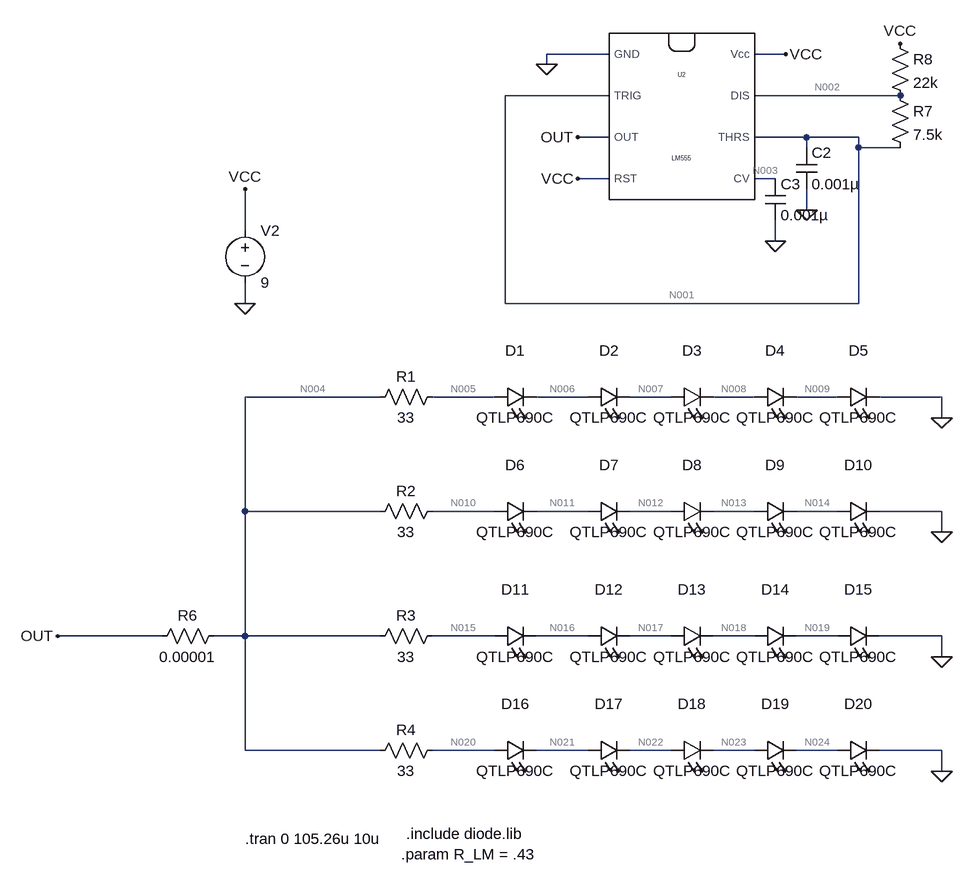
[diagram p0: schematic IR_Tx.asc]
IR_Tx.asc, the LTspice schematic file:
Version 4
SHEET 1 1028 680
WIRE 496 -848 400 -848
WIRE 768 -848 720 -848
WIRE 400 -832 400 -848
WIRE 496 -784 336 -784
WIRE 944 -784 720 -784
WIRE 496 -720 448 -720
WIRE 800 -720 720 -720
WIRE 880 -720 800 -720
WIRE 800 -704 800 -720
WIRE 880 -704 880 -720
WIRE 944 -704 880 -704
WIRE 496 -656 448 -656
WIRE 752 -656 720 -656
WIRE 800 -608 800 -640
WIRE -64 -576 -64 -640
WIRE 752 -560 752 -592
WIRE -64 -464 -64 -496
WIRE 336 -464 336 -784
WIRE 880 -464 880 -704
WIRE 880 -464 336 -464
WIRE 144 -320 -64 -320
WIRE 320 -320 224 -320
WIRE 464 -320 384 -320
WIRE 592 -320 528 -320
WIRE 720 -320 656 -320
WIRE 848 -320 784 -320
WIRE 1008 -320 912 -320
WIRE 1008 -288 1008 -320
WIRE -64 -144 -64 -320
WIRE 144 -144 -64 -144
WIRE 320 -144 224 -144
WIRE 464 -144 384 -144
WIRE 592 -144 528 -144
WIRE 720 -144 656 -144
WIRE 848 -144 784 -144
WIRE 1008 -144 912 -144
WIRE 1008 -112 1008 -144
WIRE -192 48 -352 48
WIRE -64 48 -64 -144
WIRE -64 48 -112 48
WIRE 144 48 -64 48
WIRE 320 48 224 48
WIRE 464 48 384 48
WIRE 592 48 528 48
WIRE 720 48 656 48
WIRE 848 48 784 48
WIRE 1008 48 912 48
WIRE 1008 80 1008 48
WIRE -64 224 -64 48
WIRE 144 224 -64 224
WIRE 320 224 224 224
WIRE 464 224 384 224
WIRE 592 224 528 224
WIRE 720 224 656 224
WIRE 848 224 784 224
WIRE 1008 224 912 224
WIRE 1008 256 1008 224
FLAG 1008 -288 0
FLAG 1008 -112 0
FLAG 1008 80 0
FLAG 1008 256 0
FLAG -64 -464 0
FLAG -64 -640 VCC
FLAG 400 -832 0
FLAG 800 -608 0
FLAG 944 -864 VCC
FLAG 768 -848 VCC
FLAG 448 -720 OUT
FLAG 448 -656 VCC
FLAG 752 -560 0
FLAG -352 48 OUT
SYMBOL res 240 -336 R90
WINDOW 0 0 56 VBottom 2
WINDOW 3 32 56 VTop 2
SYMATTR InstName R1
SYMATTR Value 33
SYMBOL LED 320 -304 R270
WINDOW 0 72 32 VTop 2
WINDOW 3 0 32 VBottom 2
SYMATTR InstName D1
SYMATTR Value QTLP690C
SYMBOL LED 464 -304 R270
WINDOW 0 72 32 VTop 2
WINDOW 3 0 32 VBottom 2
SYMATTR InstName D2
SYMATTR Value QTLP690C
SYMBOL LED 592 -304 R270
WINDOW 0 72 32 VTop 2
WINDOW 3 0 32 VBottom 2
SYMATTR InstName D3
SYMATTR Value QTLP690C
SYMBOL LED 720 -304 R270
WINDOW 0 72 32 VTop 2
WINDOW 3 0 32 VBottom 2
SYMATTR InstName D4
SYMATTR Value QTLP690C
SYMBOL LED 848 -304 R270
WINDOW 0 72 32 VTop 2
WINDOW 3 0 32 VBottom 2
SYMATTR InstName D5
SYMATTR Value QTLP690C
SYMBOL res 240 -160 R90
WINDOW 0 0 56 VBottom 2
WINDOW 3 32 56 VTop 2
SYMATTR InstName R2
SYMATTR Value 33
SYMBOL LED 320 -128 R270
WINDOW 0 72 32 VTop 2
WINDOW 3 0 32 VBottom 2
SYMATTR InstName D6
SYMATTR Value QTLP690C
SYMBOL LED 464 -128 R270
WINDOW 0 72 32 VTop 2
WINDOW 3 0 32 VBottom 2
SYMATTR InstName D7
SYMATTR Value QTLP690C
SYMBOL LED 592 -128 R270
WINDOW 0 72 32 VTop 2
WINDOW 3 0 32 VBottom 2
SYMATTR InstName D8
SYMATTR Value QTLP690C
SYMBOL LED 720 -128 R270
WINDOW 0 72 32 VTop 2
WINDOW 3 0 32 VBottom 2
SYMATTR InstName D9
SYMATTR Value QTLP690C
SYMBOL LED 848 -128 R270
WINDOW 0 72 32 VTop 2
WINDOW 3 0 32 VBottom 2
SYMATTR InstName D10
SYMATTR Value QTLP690C
SYMBOL res 240 32 R90
WINDOW 0 0 56 VBottom 2
WINDOW 3 32 56 VTop 2
SYMATTR InstName R3
SYMATTR Value 33
SYMBOL LED 320 64 R270
WINDOW 0 72 32 VTop 2
WINDOW 3 0 32 VBottom 2
SYMATTR InstName D11
SYMATTR Value QTLP690C
SYMBOL LED 464 64 R270
WINDOW 0 72 32 VTop 2
WINDOW 3 0 32 VBottom 2
SYMATTR InstName D12
SYMATTR Value QTLP690C
SYMBOL LED 592 64 R270
WINDOW 0 72 32 VTop 2
WINDOW 3 0 32 VBottom 2
SYMATTR InstName D13
SYMATTR Value QTLP690C
SYMBOL LED 720 64 R270
WINDOW 0 72 32 VTop 2
WINDOW 3 0 32 VBottom 2
SYMATTR InstName D14
SYMATTR Value QTLP690C
SYMBOL LED 848 64 R270
WINDOW 0 72 32 VTop 2
WINDOW 3 0 32 VBottom 2
SYMATTR InstName D15
SYMATTR Value QTLP690C
SYMBOL res 240 208 R90
WINDOW 0 0 56 VBottom 2
WINDOW 3 32 56 VTop 2
SYMATTR InstName R4
SYMATTR Value 33
SYMBOL LED 320 240 R270
WINDOW 0 72 32 VTop 2
WINDOW 3 0 32 VBottom 2
SYMATTR InstName D16
SYMATTR Value QTLP690C
SYMBOL LED 464 240 R270
WINDOW 0 72 32 VTop 2
WINDOW 3 0 32 VBottom 2
SYMATTR InstName D17
SYMATTR Value QTLP690C
SYMBOL LED 592 240 R270
WINDOW 0 72 32 VTop 2
WINDOW 3 0 32 VBottom 2
SYMATTR InstName D18
SYMATTR Value QTLP690C
SYMBOL LED 720 240 R270
WINDOW 0 72 32 VTop 2
WINDOW 3 0 32 VBottom 2
SYMATTR InstName D19
SYMATTR Value QTLP690C
SYMBOL LED 848 240 R270
WINDOW 0 72 32 VTop 2
WINDOW 3 0 32 VBottom 2
SYMATTR InstName D20
SYMATTR Value QTLP690C
SYMBOL res -208 64 R270
WINDOW 0 32 56 VTop 2
WINDOW 3 0 56 VBottom 2
SYMATTR InstName R6
SYMATTR Value 0.00001
SYMBOL LM555 608 -752 R0
SYMATTR InstName U2
SYMBOL res 928 -800 R0
SYMATTR InstName R7
SYMATTR Value 7.5k
SYMBOL voltage -64 -592 R0
WINDOW 123 0 0 Left 2
WINDOW 39 0 0 Left 2
SYMATTR InstName V2
SYMATTR Value 9
SYMBOL cap 784 -704 R0
SYMATTR InstName C2
SYMATTR Value 0.001µ
SYMBOL res 928 -880 R0
SYMATTR InstName R8
SYMATTR Value 22k
SYMBOL cap 736 -656 R0
SYMATTR InstName C3
SYMATTR Value 0.001µ
TEXT 176 384 Left 2 !.param R_LM = .43
TEXT -64 360 Left 2 !.tran 0 105.26u 10u
TEXT 184 352 Left 2 !.include diode.lib

The netlist it stands for:
* IR_Tx.asc
R1 N005 N004 33
D1 N005 N006 QTLP690C
D2 N006 N007 QTLP690C
D3 N007 N008 QTLP690C
D4 N008 N009 QTLP690C
D5 N009 0 QTLP690C
R2 N010 N004 33
D6 N010 N011 QTLP690C
D7 N011 N012 QTLP690C
D8 N012 N013 QTLP690C
D9 N013 N014 QTLP690C
D10 N014 0 QTLP690C
R3 N015 N004 33
D11 N015 N016 QTLP690C
D12 N016 N017 QTLP690C
D13 N017 N018 QTLP690C
D14 N018 N019 QTLP690C
D15 N019 0 QTLP690C
R4 N020 N004 33
D16 N020 N021 QTLP690C
D17 N021 N022 QTLP690C
D18 N022 N023 QTLP690C
D19 N023 N024 QTLP690C
D20 N024 0 QTLP690C
R6 OUT N004 0.00001
XU2 0 N001 OUT VCC N003 N001 N002 VCC NE555  ; pins GND TRIG OUT RST CV THRS DIS Vcc
R7 N002 N001 7.5k
V2 VCC 0 9
C2 N001 0 0.001µ
R8 VCC N002 22k
C3 N003 0 0.001µ
.model D D
.lib standard.dio
.param R_LM = .43
.tran 0 105.26u 10u
.include diode.lib
.lib NE555.sub
.backanno
.end

* Results of the author's LTspice run, read from the files saved beside the schematic
* Operating Point, zero values left out:
*   V(n005) = 8.814 V
*   V(n004) = 8.922 V
*   V(n006) = 7.051 V
*   V(n007) = 5.288 V
*   V(n008) = 3.526 V
*   V(n009) = 1.763 V
*   V(n010) = 8.814 V
*   V(n011) = 7.051 V
*   V(n012) = 5.288 V
*   V(n013) = 3.526 V
*   V(n014) = 1.763 V
*   V(n015) = 8.814 V
*   V(n016) = 7.051 V
*   V(n017) = 5.288 V
*   V(n018) = 3.526 V
*   V(n019) = 1.763 V
*   V(n020) = 8.814 V
*   V(n021) = 7.051 V
*   V(n022) = 5.288 V
*   V(n023) = 3.526 V
*   V(n024) = 1.763 V
*   V(out) = 8.922 V
*   V(n001) = 8.999 V
*   V(n003) = 6 V
*   V(vcc) = 9 V
*   V(n002) = 8.999 V
*   I(D20) = 3.262 mA
*   I(D19) = 3.262 mA
*   I(D18) = 3.262 mA
*   I(D17) = 3.262 mA
*   I(D16) = 3.262 mA
*   I(D15) = 3.262 mA
*   I(D14) = 3.262 mA
*   I(D13) = 3.262 mA
*   I(D12) = 3.262 mA
*   I(D11) = 3.262 mA
*   I(D10) = 3.262 mA
*   I(D9) = 3.262 mA
*   I(D8) = 3.262 mA
*   I(D7) = 3.262 mA
*   I(D6) = 3.262 mA
*   I(D5) = 3.262 mA
*   I(D4) = 3.262 mA
*   I(D3) = 3.262 mA
*   I(D2) = 3.262 mA
*   I(D1) = 3.262 mA
*   I(R8) = 30.01 nA
*   I(R7) = 18 nA
*   I(R6) = 13.05 mA
*   I(R4) = -3.262 mA
*   I(R3) = -3.262 mA
*   I(R2) = -3.262 mA
*   I(R1) = -3.262 mA
*   I(V2) = -15.96 mA
*   Ix(u2:1) = -2.908 mA
*   Ix(u2:2) = 8.999 nA
*   Ix(u2:3) = -13.05 mA
*   Ix(u2:4) = 49.33 µA
*   Ix(u2:6) = 8.999 nA
*   Ix(u2:7) = 12.01 nA
*   Ix(u2:8) = 15.91 mA
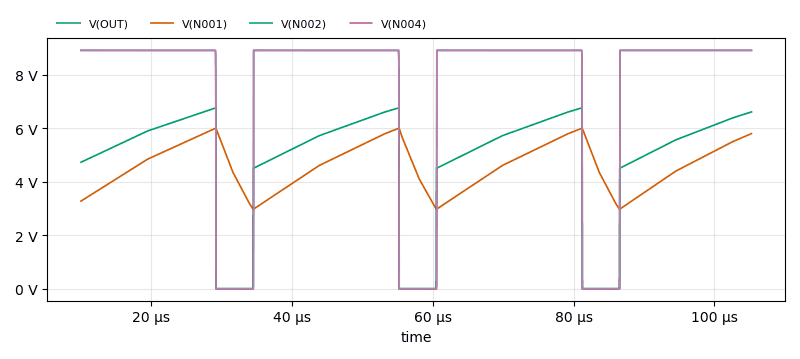
[diagram p1: Transient Analysis of IR_Tx.asc, plotted from the saved traces]
* Transient Analysis, 1 run:
*   V(OUT): min 53.99 µV, max 8.922 V, average 7.418 V, rms 8.134 V, last 8.922 V
*   V(N001): min 2.973 V, max 6.014 V, average 4.589 V, rms 4.701 V, last 5.807 V
*   V(N002): min 4.835 mV, max 6.772 V, average 4.789 V, rms 5.29 V, last 6.619 V
*   V(N004): min 53.99 µV, max 8.922 V, average 7.418 V, rms 8.134 V, last 8.922 V